# EAGLE schematic Kicker Board (EAGLE 9.1.1)
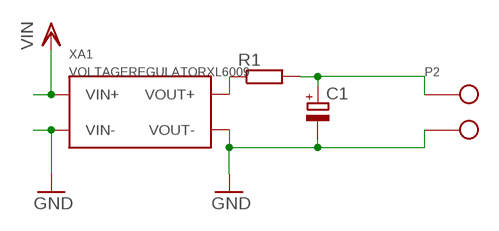
[diagram p0: schematic, sheet 1]

## Parts
C1  CPOL-EUE10-35  [EB35D]
P2  TERMINALBLOCK0.15"  [TERMINALBLOCK0.15"]
R1  R-EU_0922/22  [0922/22]
XA1  VOLTAGEREGULATORXL6009  [XL6009PCB]

## Nets
GND: C1.- P2.P$2(PIN2) XA1.IN-(VIN-) XA1.OUT-(VOUT-)
N$1: R1.1 XA1.OUT+(VOUT+)
N$2: C1.+ P2.P$1(PIN1) R1.2
VIN: XA1.IN+(VIN+)

## Library data of the parts
C1 = rcl:CPOL-EU: POLARIZED CAPACITOR, European symbol; SPICEPREFIX: C
P2 = Robocup:TERMINALBLOCK0.15"
R1 = rcl:R-EU_: RESISTOR, European symbol; SPICEPREFIX: R
XA1 = Robocup:VOLTAGEREGULATOR